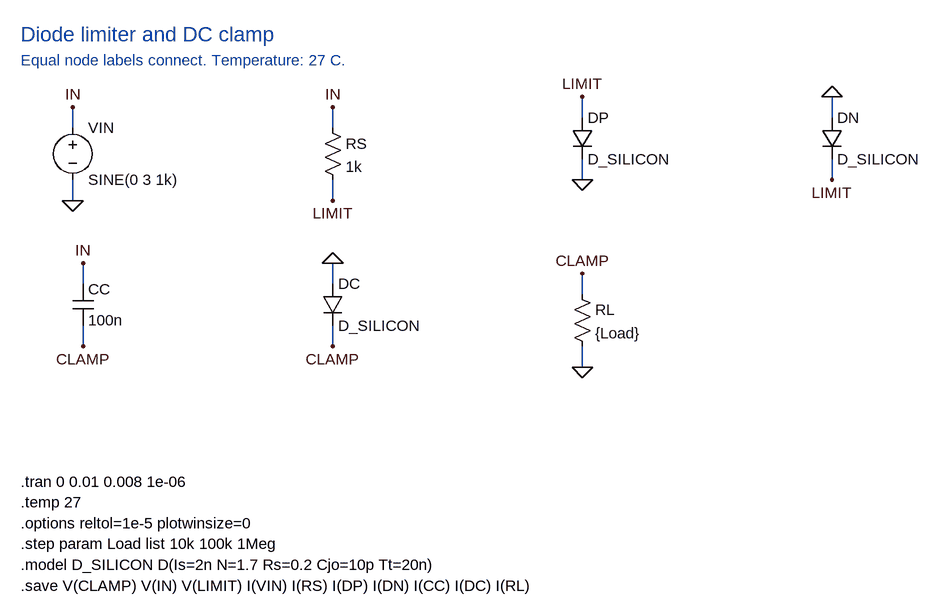
[diagram p0: schematic diode-limiter-clamp.asc]
diode-limiter-clamp.asc, the LTspice schematic file:
Version 4
SHEET 1 1740 1032
WIRE 144 176 144 144
WIRE 144 256 144 288
WIRE 544 176 544 144
WIRE 544 256 544 288
WIRE 928 160 928 128
WIRE 928 224 928 256
WIRE 1312 160 1312 128
WIRE 1312 224 1312 256
WIRE 160 416 160 384
WIRE 160 480 160 512
WIRE 544 416 544 384
WIRE 544 480 544 512
WIRE 928 432 928 400
WIRE 928 512 928 544
FLAG 144 144 IN
FLAG 144 288 0
FLAG 544 144 IN
FLAG 544 288 LIMIT
FLAG 928 128 LIMIT
FLAG 928 256 0
FLAG 1312 128 0
FLAG 1312 256 LIMIT
FLAG 160 384 IN
FLAG 160 512 CLAMP
FLAG 544 384 0
FLAG 544 512 CLAMP
FLAG 928 400 CLAMP
FLAG 928 544 0
SYMBOL voltage 144 160 R0
SYMATTR InstName VIN
SYMATTR Value SINE(0 3 1k)
SYMBOL res 528 160 R0
SYMATTR InstName RS
SYMATTR Value 1k
SYMBOL diode 912 160 R0
SYMATTR InstName DP
SYMATTR Value D_SILICON
SYMBOL diode 1296 160 R0
SYMATTR InstName DN
SYMATTR Value D_SILICON
SYMBOL cap 144 416 R0
SYMATTR InstName CC
SYMATTR Value 100n
SYMBOL diode 528 416 R0
SYMATTR InstName DC
SYMATTR Value D_SILICON
SYMBOL res 912 416 R0
SYMATTR InstName RL
SYMATTR Value {Load}
TEXT 64 32 Left 3 ;Diode limiter and DC clamp
TEXT 64 72 Left 2 ;Equal node labels connect. Temperature: 27 C.
TEXT 64 720 Left 2 !.tran 0 0.01 0.008 1e-06
TEXT 64 752 Left 2 !.temp 27
TEXT 64 784 Left 2 !.options reltol=1e-5 plotwinsize=0
TEXT 64 816 Left 2 !.step param Load list 10k 100k 1Meg
TEXT 64 848 Left 2 !.model D_SILICON D(Is=2n N=1.7 Rs=0.2 Cjo=10p Tt=20n)
TEXT 64 880 Left 2 !.save V(CLAMP) V(IN) V(LIMIT) I(VIN) I(RS) I(DP) I(DN) I(CC) I(DC) I(RL)

The netlist it stands for:
* diode-limiter-clamp.asc
VIN IN 0 SINE(0 3 1k)
RS IN LIMIT 1k
DP LIMIT 0 D_SILICON
DN 0 LIMIT D_SILICON
CC IN CLAMP 100n
DC 0 CLAMP D_SILICON
RL CLAMP 0 {Load}
.model D D
.lib standard.dio
* Diode limiter and DC clamp
* Equal node labels connect. Temperature: 27 C.
.tran 0 0.01 0.008 1e-06
.temp 27
.options reltol=1e-5 plotwinsize=0
.step param Load list 10k 100k 1Meg
.model D_SILICON D(Is=2n N=1.7 Rs=0.2 Cjo=10p Tt=20n)
.save V(CLAMP) V(IN) V(LIMIT) I(VIN) I(RS) I(DP) I(DN) I(CC) I(DC) I(RL)
.backanno
.end